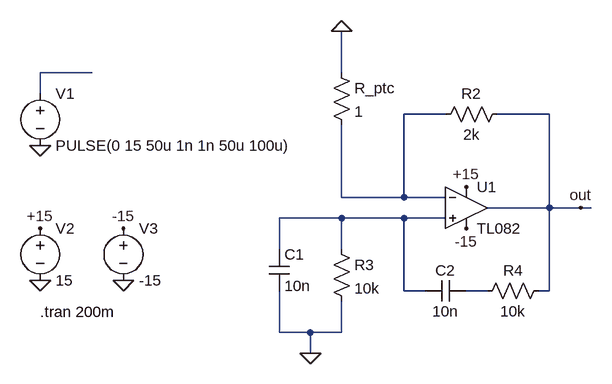
[diagram p0: schematic wien_bridge.asc]
wien_bridge.asc, the LTspice schematic file:
Version 4
SHEET 1 880 680
WIRE -384 -112 -464 -112
WIRE 0 -112 0 -176
WIRE -464 -80 -464 -112
WIRE 160 -48 96 -48
WIRE 320 -48 240 -48
WIRE 0 80 0 -32
WIRE 96 80 96 -48
WIRE 96 80 0 80
WIRE 160 80 96 80
WIRE 320 96 320 -48
WIRE 320 96 224 96
WIRE 368 96 320 96
WIRE 384 96 368 96
WIRE 0 112 -96 112
WIRE 96 112 0 112
WIRE 160 112 96 112
WIRE -96 160 -96 112
WIRE 0 160 0 112
WIRE 96 224 96 112
WIRE 128 224 96 224
WIRE 224 224 192 224
WIRE 320 224 320 96
WIRE 320 224 304 224
WIRE -96 288 -96 224
WIRE -48 288 -96 288
WIRE 0 288 0 240
WIRE 0 288 -48 288
WIRE -48 320 -48 288
FLAG -464 208 0
FLAG -336 208 0
FLAG -464 128 +15
FLAG -336 128 -15
FLAG 192 64 +15
FLAG 192 128 -15
FLAG 0 -176 0
FLAG -48 320 0
FLAG 368 96 out
FLAG -464 0 0
SYMBOL voltage -464 112 R0
WINDOW 123 0 0 Left 0
WINDOW 39 0 0 Left 0
SYMATTR InstName V2
SYMATTR Value 15
SYMBOL voltage -336 112 R0
WINDOW 123 0 0 Left 0
WINDOW 39 0 0 Left 0
SYMATTR InstName V3
SYMATTR Value -15
SYMBOL TL082 192 96 R0
SYMATTR InstName U1
SYMBOL res -16 -128 R0
SYMATTR InstName R_ptc
SYMATTR Value 1
SYMBOL res 256 -64 R90
WINDOW 0 0 56 VBottom 2
WINDOW 3 32 56 VTop 2
SYMATTR InstName R2
SYMATTR Value 2k
SYMBOL res -16 144 R0
SYMATTR InstName R3
SYMATTR Value 10k
SYMBOL cap -112 160 R0
SYMATTR InstName C1
SYMATTR Value 10n
SYMBOL res 320 208 R90
WINDOW 0 0 56 VBottom 2
WINDOW 3 32 56 VTop 2
SYMATTR InstName R4
SYMATTR Value 10k
SYMBOL cap 192 208 R90
WINDOW 0 0 32 VBottom 2
WINDOW 3 32 32 VTop 2
SYMATTR InstName C2
SYMATTR Value 10n
SYMBOL voltage -464 -96 R0
WINDOW 123 0 0 Left 0
WINDOW 39 0 0 Left 0
SYMATTR InstName V1
SYMATTR Value PULSE(0 15 50u 1n 1n 50u 100u)
TEXT -464 256 Left 2 !.tran 200m

The netlist it stands for:
* wien_bridge.asc
V2 +15 0 15
V3 -15 0 -15
* U1: TL082 (symbol TL082 not available, pins judged from their places): In+=N003 In-=N002 V+=+15 V-=-15 OUT=out
R_ptc 0 N002 1
R2 out N002 2k
R3 N003 0 10k
C1 N003 0 10n
R4 out N004 10k
C2 N004 N003 10n
V1 N001 0 PULSE(0 15 50u 1n 1n 50u 100u)
.tran 200m
.backanno
.end